# Altium project RUT_xE310_GNSS.PrjPCB
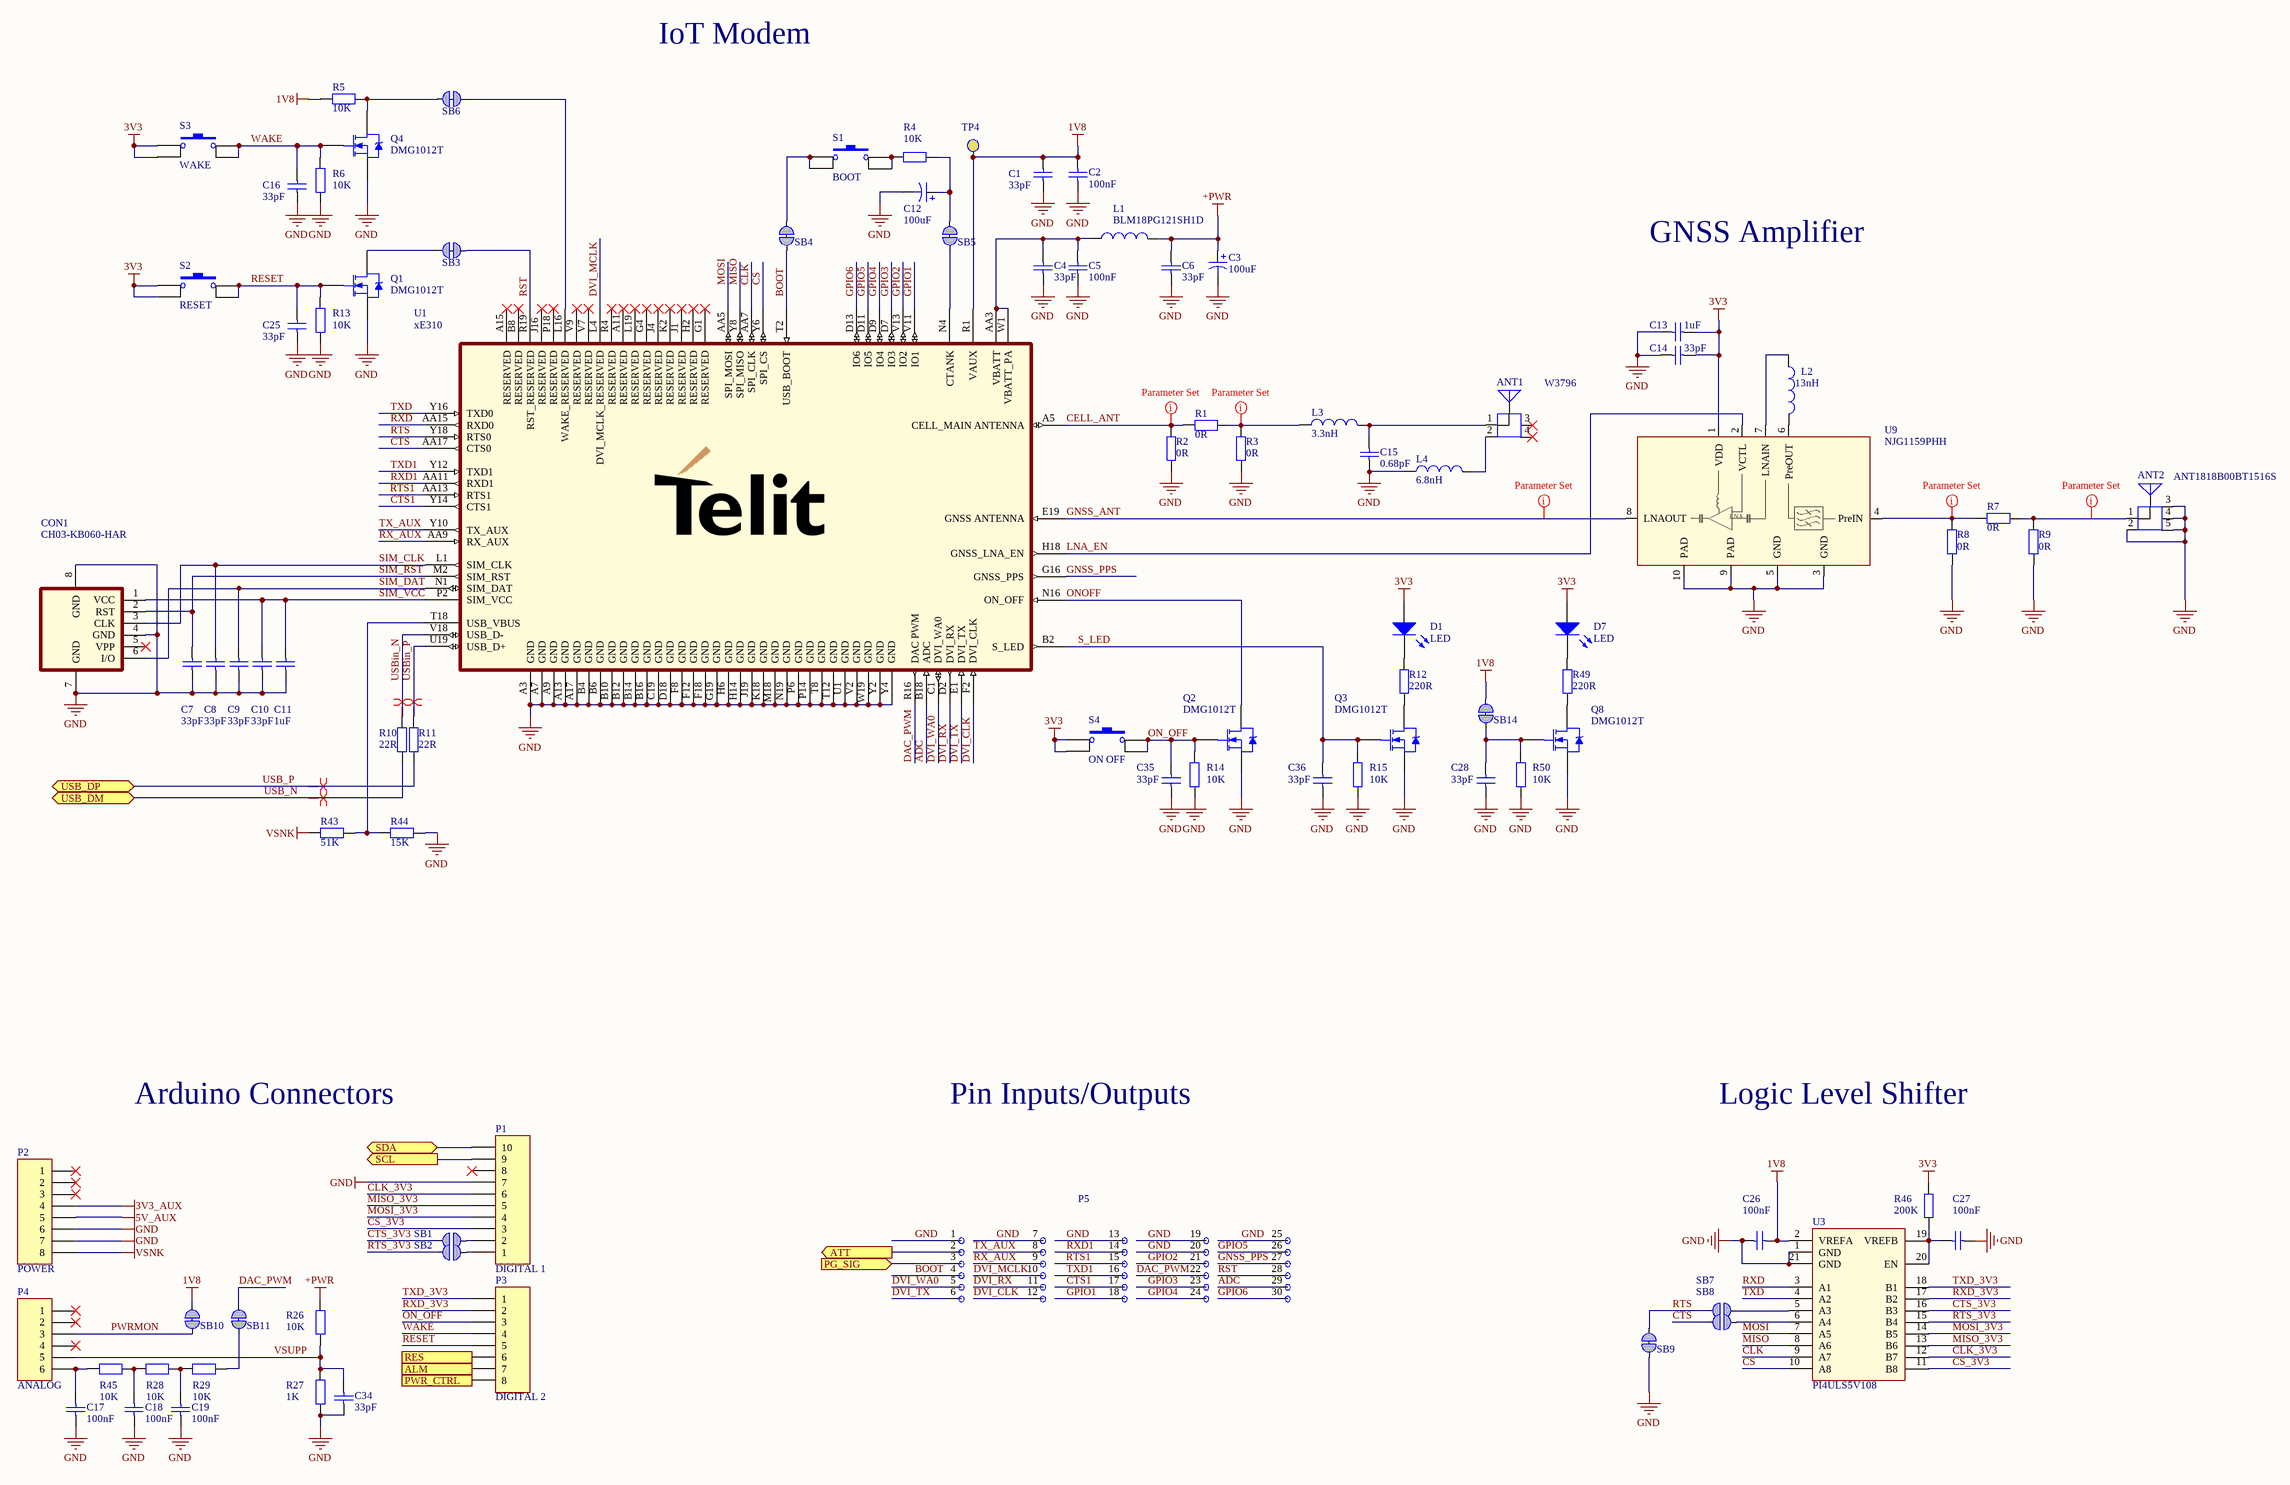
[diagram p0: Main_Schematic.SchDoc]
3 sheets, 158 parts. Net scope: flat (ports and power ports of the same name join across sheets).
Board files: RUT_xE310_PCB.PcbDoc, RUT_xE310_Panel.PcbDoc
Sheets:
  Main_Schematic.SchDoc
  USBPD_Sink.SchDoc
  Power.SchDoc

## Sheet Main_Schematic.SchDoc
size A2

### Parts
ANT1  W3796  [W3796]
ANT2  ANT1818B00BT1516S  [ANT1818B00BT1516S]
C1  value 33pF  [C0402]  (hidden comment: Cap Semi)
C2  value 100nF  [C0402]  (hidden comment: Cap Semi)
C3  value 100uF  [Case-B]  (hidden comment: electrolytic capacitor)
C4  value 33pF  [C0402]  (hidden comment: Cap Semi)
C5  value 100nF  [C0402]  (hidden comment: Cap Semi)
C6  value 33pF  [C0402]  (hidden comment: Cap Semi)
C7  value 33pF  [C0402]  (hidden comment: Cap Semi)
C8  value 33pF  [C0402]  (hidden comment: Cap Semi)
C9  value 33pF  [C0402]  (hidden comment: Cap Semi)
C10  value 33pF  [C0402]  (hidden comment: Cap Semi)
C11  value 1uF  [C0402]  (hidden comment: Cap Semi)
C12  value 100uF  [Case-B]  (hidden comment: electrolytic capacitor)
C13  value 1uF  [C0402]  (hidden comment: Cap Semi)
C14  value 33pF  [C0402]  (hidden comment: Cap Semi)
C15  value 0.68pF  [C0402]  (hidden comment: Cap Semi)
C16  value 33pF  [C0402]  (hidden comment: Cap Semi)
C17  value 100nF  [C0402]  (hidden comment: Cap Semi)
C18  value 100nF  [C0402]  (hidden comment: Cap Semi)
C19  value 100nF  [C0402]  (hidden comment: Cap Semi)
C25  value 33pF  [C0402]  (hidden comment: Cap Semi)
C26  value 100nF  [C0402]  (hidden comment: Cap Semi)
C27  value 100nF  [C0402]  (hidden comment: Cap Semi)
C28  value 33pF  [C0402]  (hidden comment: Cap Semi)
C34  value 33pF  [C0402]  (hidden comment: Cap Semi)
C35  value 33pF  [C0402]  (hidden comment: Cap Semi)
C36  value 33pF  [C0402]  (hidden comment: Cap Semi)
CON1  CH03-KB060-HAR  [CH03-KB]
D1  LED  [PICOLED]
D7  LED  [PICOLED]
L1  value BLM18PG121SH1D  [L0603]  (hidden comment: Inductor)
L2  value 13nH  [L0402]  (hidden comment: Inductor)
L3  value 3.3nH  [L0603]  (hidden comment: Inductor)
L4  value 6.8nH  [L0603]  (hidden comment: Inductor)
P1  DIGITAL 1  [HDR1X10]
P2  POWER  [HDR1X8]  (no BOM)
P3  DIGITAL 2  [HDR1X8]  (no BOM)
P4  ANALOG  [HDR1X6]  (no BOM)
P5  THT_Matrix  [THT_Matrix_5x6]  (value not drawn)  (no BOM)
Q1  DMG1012T  [SOT-523_custom]
Q2  DMG1012T  [SOT-523_custom]
Q3  DMG1012T  [SOT-523_custom]
Q4  DMG1012T  [SOT-523_custom]
Q8  DMG1012T  [SOT-523_custom]
R1  value 0R  [R0402]  (hidden comment: Res2)
R2  value 0R  [R0402]  (hidden comment: Res2)
R3  value 0R  [R0402]  (hidden comment: Res2)
R4  value 10K  [R0402]  (hidden comment: Res2)
R5  value 10K  [R0402]  (hidden comment: Res2)
R6  value 10K  [R0402]  (hidden comment: Res2)
R7  value 0R  [R0402]  (hidden comment: Res2)
R8  value 0R  [R0402]  (hidden comment: Res2)
R9  value 0R  [R0402]  (hidden comment: Res2)
R10  value 22R  [R0402]  (hidden comment: Res2)
R11  value 22R  [R0402]  (hidden comment: Res2)
R12  value 220R  [R0402]  (hidden comment: Res2)
R13  value 10K  [R0402]  (hidden comment: Res2)
R14  value 10K  [R0402]  (hidden comment: Res2)
R15  value 10K  [R0402]  (hidden comment: Res2)
R26  value 10K  [R0402]  (hidden comment: Res2)
R27  value 1K  [R0402]  (hidden comment: Res2)
R28  value 10K  [R0402]  (hidden comment: Res2)
R29  value 10K  [R0402]  (hidden comment: Res2)
R43  value 51K  [R0402]  (hidden comment: Res2)
R44  value 15K  [R0402]  (hidden comment: Res2)
R45  value 10K  [R0402]  (hidden comment: Res2)
R46  value 200K  [R0402]  (hidden comment: Res2)
R49  value 220R  [R0402]  (hidden comment: Res2)
R50  value 10K  [R0402]  (hidden comment: Res2)
S1  BOOT  [EVPAA002K]
S2  RESET  [EVPAA002K]
S3  WAKE  [EVPAA002K]
S4  ON OFF  [EVQPUA]
SB1  Solderbridge  [Solderbridge]  (value not drawn)  (no BOM)
SB2  Solderbridge  [Solderbridge]  (value not drawn)  (no BOM)
SB3  Solderbridge  [Solderbridge_Shorted]  (value not drawn)  (net tie, no BOM)
SB4  Solderbridge  [Solderbridge_Shorted]  (value not drawn)  (net tie, no BOM)
SB5  Solderbridge  [Solderbridge_Shorted]  (value not drawn)  (net tie, no BOM)
SB6  Solderbridge  [Solderbridge_Shorted]  (value not drawn)  (net tie, no BOM)
SB7  Solderbridge  [Solderbridge]  (value not drawn)  (no BOM)
SB8  Solderbridge  [Solderbridge]  (value not drawn)  (no BOM)
SB9  Solderbridge  [Solderbridge_Shorted]  (value not drawn)  (net tie, no BOM)
SB10  Solderbridge  [Solderbridge_Shorted]  (value not drawn)  (net tie, no BOM)
SB11  Solderbridge  [Solderbridge_Shorted]  (value not drawn)  (net tie, no BOM)
SB14  Solderbridge  [Solderbridge_Shorted]  (value not drawn)  (net tie, no BOM)
TP4  Test_Point  [TEST_POINT]  (value not drawn)  (no BOM)
U1  xE310  [LGA_GE310]
U3  PI4ULS5V108  [VQFN-20]
U9  NJG1159PHH  [HFFP10-HH]

### Ports
ALM (out), ATT (out), PG_SIG (in), PWR_CTRL (out), RES (out), SCL (out), SDA (bidir), USB_DM (bidir), USB_DP (bidir)

### Nets
1V8: C1.1 C2.2 C26.2 R5.2 SB10.1 SB14.1 TP4.0 U1.R1(VAUX) U3.2(VREFA)
3V3: C13.1 C14.1 D1.1(A) D7.1(A) R46.2 S2.1 S2.4 S3.1 S3.4 S4.1 S4.3 U9.1(VDD)
3V3_AUX: P2.4
5V_AUX: P2.5
+PWR: C3.1 C6.2 L1.2 R26.2
GND: ANT2.2 ANT2.3 ANT2.4 ANT2.5 C1.2 C2.1 C3.2 C4.1 C5.1 C6.1 C7.2 C8.2 C9.2 C10.2 C11.1 C12.2 C13.2 C14.2 C15.2 C16.2 C17.2 C18.2 C19.2 C25.2 C26.1 C27.2 C28.2 C34.1 C35.2 C36.2 CON1.4(GND) CON1.7(GND) CON1.8(GND) L4.1 P1.7 P2.6 P2.7 P5.1 P5.7 P5.13 P5.19 P5.20 P5.25 Q1.3(S) Q2.3(S) Q3.3(S) Q4.3(S) Q8.3(S) R2.2 R3.2 R6.1 R8.2 R9.2 R13.1 R14.1 R15.1 R27.1 R44.1 R50.1 SB9.2 U1.A3(GND) U1.A7(GND) U1.A9(GND) U1.A13(GND) U1.A17(GND) U1.B4(GND) U1.B6(GND) U1.B10(GND) U1.B12(GND) U1.B14(GND) U1.B16(GND) U1.C19(GND) U1.D18(GND) U1.F8(GND) U1.F12(GND) U1.F18(GND) U1.G19(GND) U1.H6(GND) U1.H14(GND) U1.J19(GND) U1.K18(GND) U1.M18(GND) U1.N19(GND) U1.P6(GND) U1.P14(GND) U1.T8(GND) U1.T12(GND) U1.U1(GND) U1.V2(GND) U1.W19(GND) U1.Y2(GND) U1.Y4(GND) U3.1(GND) U3.21(GND) U9.3(GND) U9.5(GND) U9.9(PAD) U9.10(PAD)
VSNK: P2.8 R43.2
ADC: P5.29 U1.B18(ADC)
ALARM: P3.7 ; port ALM
BOOT: P5.4 SB4.2 U1.T2(USB_BOOT)
CELL_ANT: R1.2 R2.1 U1.A5(CELL_MAIN_ANTENNA)
CLK: U1.AA7(SPI_CLK) U3.9(A7)
CLK_3V3: P1.6 U3.12(B7)
CS: U1.Y6(SPI_CS) U3.10(A8)
CS_3V3: P1.3 U3.11(B8)
CTS: SB8.1 U1.AA17(CTS0)
CTS1: P5.17 U1.Y14(CTS1)
CTS_3V3: SB1.1 U3.16(B3)
DAC_PWM: P5.22 SB11.1 U1.R16(DAC_PWM)
DVI_CLK: P5.12 U1.F2(DVI_CLK)
DVI_MCLK: P5.10 U1.L4(DVI_MCLK_RESERVED)
DVI_RX: P5.11 U1.D2(DVI_RX)
DVI_TX: P5.6 U1.E1(DVI_TX)
DVI_WA0: P5.5 U1.C1(DVI_WA0)
GNSS_ANT: U1.E19(GNSS_ANTENNA) U9.8(LNAOUT)
GNSS_PPS: P5.27 U1.G16(GNSS_PPS)
GPIO1: P5.18 U1.V11(IO1)
GPIO2: P5.21 U1.V13(IO2)
GPIO3: P5.23 U1.D7(IO3)
GPIO4: P5.24 U1.D9(IO4)
GPIO5: P5.26 U1.D11(IO5)
GPIO6: P5.30 U1.D13(IO6)
LNA_EN: U1.H18(GNSS_LNA_EN) U9.2(VCTL)
MISO: U1.Y8(SPI_MISO) U3.8(A6)
MISO_3V3: P1.5 U3.13(B6)
MOSI: U1.AA5(SPI_MOSI) U3.7(A5)
MOSI_3V3: P1.4 U3.14(B5)
ON_OFF: C35.1 P3.3 Q2.1(G) R14.2 S4.2 S4.4
ONOFF: Q2.2(D) U1.N16(ON_OFF)
PG: P5.3 ; port PG_SIG
PWRMON: P4.3 SB10.2
RESET: C25.1 P3.5 Q1.1(G) R13.2 S2.2 S2.3
RST: P5.28 SB3.1 U1.R19(RST_RESERVED)
RTS: SB7.1 SB9.1 U1.Y18(RTS0)
RTS1: P5.15 U1.AA13(RTS1)
RTS_3V3: SB2.1 U3.15(B4)
RX_AUX: P5.9 U1.AA9(RX_AUX)
RXD: U1.AA15(RXD0) U3.3(A1)
RXD1: P5.14 U1.AA11(RXD1)
RXD_3V3: P3.2 U3.17(B2)
S_LED: C36.1 Q3.1(G) R15.2 U1.B2(S_LED)
SCL: P1.9 ; port SCL
SDA: P1.10 ; port SDA
SIM_CLK: C8.1 CON1.3(CLK) U1.L1(SIM_CLK)
SIM_DAT: C9.1 CON1.6(I/O) U1.N1(SIM_DAT)
SIM_RST: C7.1 CON1.2(RST) U1.M2(SIM_RST)
SIM_VCC: C10.1 C11.2 CON1.1(VCC) U1.P2(SIM_VCC)
TX_AUX: P5.8 U1.Y10(TX_AUX)
TXD: U1.Y16(TXD0) U3.4(A2)
TXD1: P5.16 U1.Y12(TXD1)
TXD_3V3: P3.1 U3.18(B1)
USB_N: R10.1 ; port USB_DM
USB_P: R11.1 ; port USB_DP
USBin_N: R10.2 U1.V18(USB_D-)
USBin_P: R11.2 U1.U19(USB_D+)
VSUPP: C34.2 P4.5 R26.1 R27.2
WAKE: C16.1 P3.4 Q4.1(G) R6.2 S3.2 S3.3
NetANT1_1: ANT1.1 C15.1 L3.2
NetANT1_2: ANT1.2 L4.2
NetANT2_1: ANT2.1 R7.1 R9.1
NetC4_2: C4.2 C5.2 L1.1 U1.AA3(VBATT) U1.W1(VBATT_PA)
NetC12_1: C12.1 R4.1 SB5.1
NetC17_1: C17.1 P4.6 R45.2
NetC18_1: C18.1 R28.2 R45.1
NetC19_1: C19.1 R28.1 R29.2
NetC27_1: C27.1 R46.1 U3.19(VREFB) U3.20(EN)
NetC28_1: C28.1 Q8.1(G) R50.2 SB14.2
NetC39_1: P3.8 ; port PWR_CTRL
NetD1_2: D1.2(K) R12.1
NetD7_2: D7.2(K) R49.1
NetL2_1: L2.1 U9.7(LNAIN)
NetL2_2: L2.2 U9.6(PreOUT)
NetL3_1: L3.1 R1.1 R3.1
NetP1_1: P1.1 SB2.2
NetP1_2: P1.2 SB1.2
NetP3_6: P3.6 ; port RES
NetP5_2: P5.2 ; port ATT
NetQ1_2: Q1.2(D) SB3.2
NetQ3_2: Q3.2(D) R12.2
NetQ4_2: Q4.2(D) R5.1 SB6.2
NetQ8_2: Q8.2(D) R49.2
NetR4_2: R4.2 S1.2 S1.3
NetR7_2: R7.2 R8.1 U9.4(PreIN)
NetR29_1: R29.1 SB11.2
NetR43_1: R43.1 R44.2 U1.T18(USB_VBUS)
NetS1_1: S1.1 S1.4 SB4.1
NetSB5_2: SB5.2 U1.N4(CTANK)
NetSB6_1: SB6.1 U1.L16(WAKE_RESERVED)
NetSB7_2: SB7.2 U3.5(A3)
NetSB8_2: SB8.2 U3.6(A4)

Not connected (* = marked no-connect by the designer): ANT1 3* 4*; CON1 5(VPP)*; P1 8*; P2 1* 2* 3*; P4 1* 2* 4*; U1 A11(RESERVED)* A15(RESERVED)* B8(RESERVED)* G1(RESERVED)* G4(RESERVED)* H2(RESERVED)* J1(RESERVED)* J4(RESERVED)* J16(RESERVED)* K2(RESERVED)* L19(RESERVED)* P18(RESERVED)* R4(RESERVED)* V7(RESERVED)* V9(RESERVED)*

### Layout directives
rule Clearance Constraint [Clearance = 0.2mm]; rule Width Constraint [Pref Width = 1.1mm    Min Width = 0.2mm    Max Width = 4mm]: CELL_ANT, GNSS_ANT, NetANT2_1, NetL3_1, NetR7_2
differential pair: USB_N, USB_P, USBin_N, USBin_P

### Notes on the sheet
- IoT Modem
- GNSS Amplifier
- Arduino Connectors
- Pin Inputs/Outputs
- Logic Level Shifter
- (in symbol NJG1159PHH) LNA

### Library data of the parts
ANT1 = Antenna: Generic Antenna; Manufacturer: Pulse; Part Description: LTE antenna; Specification: LTE; Manufacturer Part No.: W3796; Supplier: Rutronik; Supplier part number: WIREAC1998; Value: W3796; Link: https://www.pulselarsenantennas.com/product/w3796/
ANT2 = Antenna: Generic Antenna; Manufacturer: Yegeo; Part Description: GPS/Glonass Antenna; Specification: 1.575/1.602 GHz; Manufacturer Part No.: ANT1818B00BT1516S; Supplier: Rutronik; Supplier part number: WIREAC1868; Value: ANT1818B00BT1516S; Link: https://www.rutronik24.com/search-result/qs:ANT1818B00BT1516S/reset:0
C1 C4 C6-C10 C14 C16 C25 C28 C34-C36 = Cap Semi: Capacitor (Semiconductor SIM Model); Manufacturer: AVX; Manufacturer Part No.: 04025A330JAT2A; Part Description: Ceramic Capacitor; Specification: NP0, 50V, 5%; Supplier: Rutronik; Supplier part number: KKK13594; Link: https://www.rutronik24.com/product/avx/04025a330jat2a/3692730.html
C2 C5 C17-C19 C26 C27 = Cap Semi: Capacitor (Semiconductor SIM Model); Manufacturer: YAGEO; Manufacturer Part No.: CC0402KRX7R9BB104; Part Description: Ceramic Capacitor; Specification: X7R, 50V, 10%; Supplier: Rutronik; Supplier part number: KKK23619; Link: https://www.rutronik24.com/search-result/qs:KKK23619/reset:0
C3 C12 = Cap Pol1: Manufacturer: AVX; Manufacturer Part No.: TPSB107M006R0250; Part Description: Tantalum Capacitor; Specification: 6,3V 20%; Supplier: Rutronik; Supplier part number: TPSB107M006R0250; Link: https://www.rutronik24.com/search-result/qs:TPSB107M006R0250%20/reset:0
C11 C13 = Cap Semi: Capacitor (Semiconductor SIM Model); Manufacturer: muRata; Manufacturer Part No.: GRM155R61E105KA12D; Part Description: Ceramic Capacitor; Specification: X5R, 25V, 10%; Supplier: Rutronik; Supplier part number: KKS4987; Link: https://www.rutronik24.com/product/murata/grm155r61e105ka12d/4725132.html
C15 = Cap Semi: Capacitor (Semiconductor SIM Model); Manufacturer: YAGEO; Manufacturer Part No.: CC0402BRNPO9BNR68; Part Description: Ceramic Capacitor; Specification: NP0, 50V, 0.1pf; Supplier: Rutronik; Supplier part number: KKK18710; Link: https://www.rutronik24.com/category/ceramic-chip-commodity/case-size:0402/cn:0%252C68p/move:0
CON1 = CH03-KB060-HAR: Nano SIM Card Connector; Manufacturer: GradConn; Specification: Nano, 6 pins; Manufacturer Part No.: CH03-KB060-HAR; Supplier: Rutronik; Supplier part number: SIMCRD1002; Value: CH03-KB060-HAR; Part Description: Nano SIM Card Connector; Link: https://www.rutronik24.com/product/gradconn/ch03-kb060-har/7026333.html
D1 D7 = LED2: Typical SMD LED; Manufacturer: OSRAM; Manufacturer Part No.: LTQH9G-Q2OO-25-2Z4Y-5-R18; Specification: Green, 5mA; Value: LTQH9G-Q2OO-25-2Z4Y-5-R18; Supplier: Rutronik; Supplier part number: LED22816; Part Description: Typical SMD LED; Link: https://www.rutronik24.com/product/osram/ltqh9g-q2oo-25-2z4y-5-r18/7461152.html
L1 = Inductor: Manufacturer: muRata; Part Description: Ferrite Bead; Specification: 120R, 2A; Manufacturer Part No.: BLM18PG121SH1D; Supplier: Rutronik; Supplier part number: FE3867; Link: https://www.rutronik24.com/product/murata/blm18pg121sh1d/5885588.html
L2 = Inductor: Manufacturer: muRata; Manufacturer Part No.: LQW15AN13NG00D; Specification: 430mA, ±2%; Supplier: Rutronik; Supplier part number: LQW15AN13NG00D; Part Description: Inductor; Link: https://www.rutronik24.com/search-result/qs:%20LQW15AN13NG00D%20/reset:0
L3 = Inductor: Manufacturer: muRata; Manufacturer Part No.: LQG18HN3N3S00D; Specification: 500mA +/-0,3nH; Supplier: Rutronik; Supplier part number: IND5373; Part Description: Inductor; Link: https://www.rutronik24.com/search-result/qs:LQG18HN3N3S00D%20/reset:0
L4 = Inductor: Manufacturer: muRata; Manufacturer Part No.: LQW18AN6N8D10D; Specification: 900mA, ±0.5nH; Supplier: Rutronik; Supplier part number: LQW18AN6N8D10D; Part Description: Inductor; Link: https://www.rutronik24.com/search-result/qs:LQW18AN6N8D10D/reset:0
P1 = Header 10: Manufacturer: SparkFun Electronics; Manufacturer Part No.: PRT-11417; Part Description: Arduino Stackable Header Kit; Specification: 10 pos. 2,54mm; Value: PRT-11417; Supplier: Digi-Key; Supplier part number: 1568-1413-ND; Link: https://www.digikey.com/products/en?keywords=1568-1413-ND
P2 P3 = Header 8: Part Description: Arduino Connector; Specification: 8 pos. 2,54mm; Supplier: Rutronik
P4 = Header 6: Part Description: Arduino Connector; Specification: 6 pos. 2,54mm; Supplier: Rutronik
P5 = THT_Matrix: Pin matrix, 6 rows, 5 columns, 2.54mm pitch
Q1-Q4 Q8 = NMOS-2: N-Channel Power MOSFET; Manufacturer: Diodes Inc.; Manufacturer Part No.: DMG1012T-7; Part Description: N-Channel MOSFET; Specification: 20V, 0.63A; Value: DMG1012T-7; Supplier: Rutronik; Supplier part number: TMOSS6623; Link: https://www.rutronik24.com/product/diodes+inc/dmg1012t-7/5168665.html
R1-R3 R7-R9 = Res2: Manufacturer: YAGEO; Manufacturer Part No.: RC0402FR-070RL; Part Description: Thick Film Resistor; Specification: 5% 0,063W; Supplier: Rutronik; Supplier part number: WRC53079; Link: https://www.rutronik24.com/product/yageo/rc0402fr-070rl/5183530.html
R4-R6 R13-R15 R26 R28 R29 R45 R50 = Res2: Manufacturer: ASJ; Manufacturer Part No.: CR10-103-JK; Part Description: Thick Film Resistor; Specification: 5% 0,063W; Supplier: Rutronik; Supplier part number: WRC40976; Link: https://www.rutronik24.com/product/asj/cr10-103-jk/54295.html
R10 R11 = Res2: Manufacturer: ASJ; Manufacturer Part No.: CR10-220-JK; Part Description: Thick Film Resistor; Specification: 5% 0,063W; Supplier: Rutronik; Supplier part number: WRC34862; Link: https://www.rutronik24.com/product/asj/cr10-220-jk/51754.html
R12 R49 = Res2: Manufacturer: ASJ; Manufacturer Part No.: CR10-221-JK; Part Description: Thick Film Resistor; Specification: 5% 0,063W; Supplier: Rutronik; Supplier part number: WRC35108; Link: https://www.rutronik24.com/product/asj/cr10-221-jk/51883.html
R27 = Res2: Manufacturer: ASJ; Manufacturer Part No.: CR10-102-JK; Part Description: Thick Film Resistor; Specification: 5% 0,063W; Supplier: Rutronik; Supplier part number: WRC41426; Link: https://www.rutronik24.com/search-result/qs:CR10-102-JK/reset:0
R43 = Res2: Manufacturer: YAGEO; Manufacturer Part No.: RC0402JR-0751KL; Part Description: Thick Film Resistor; Specification: 5% 0,063W; Supplier: Rutronik; Supplier part number: WRC33877; Link: https://www.rutronik24.com/product/yageo/rc0402jr-0751kl/51045.html
R44 = Res2: Manufacturer: ASJ; Manufacturer Part No.: CR10-153-JK; Part Description: Thick Film Resistor; Specification: 5% 0,063W; Supplier: Rutronik; Supplier part number: WRC41435; Link: https://www.rutronik24.com/product/asj/cr10-153-jk/54400.html
R46 = Res2: Manufacturer: ASJ; Manufacturer Part No.: CR10-204-JK; Part Description: Thick Film Resistor; Specification: 5% 0,063W; Supplier: Rutronik; Supplier part number: WRC55047; Link: https://www.rutronik24.com/product/asj/cr10-204-jk/6641528.html
S1-S3 = EVPAA002K: Switch; Manufacturer: Panasonic; Part Description: Tactile Button; Specification: 1N, Straight , 20mA; Manufacturer Part No.: EVPAA002K; Supplier: Rutronik; Supplier part number: EVPAA002K; Value: EVPAA002K; Link: https://www.rutronik24.com/search-result/qs:EVPAA002K/reset:0
S4 = SW-PB: Switch; Manufacturer: Panasonic; Manufacturer Part No.: EVQPUJ02K; Part Description: Tactile Button; Specification: 1.6N, Right Angle, 50mA; Value: EVQPUJ02K; Supplier: Rutronik; Supplier part number: EVQPUJ02K; Link: https://www.rutronik24.com/search-result/qs:EVQPUJ02K/reset:0
SB3-SB6 SB9-SB11 SB14 = Solderbridge Shorted: Manufacturer: *; Value: Solderbridge; Supplier: *; Supplier part number: *
TP4 = Test_Point: Test Point
U1 = xE310-GNSS: xE310-GNSS IoT Modem; Manufacturer: Telit; Manufacturer Part No.: ME310G1-WW; Part Description: LTE M1/NB2 WW 2G/FB +GNSS; Specification: xE310 SMD LGA; Value: ME310G1-WW; Link: https://www.rutronik24.com/product/telit/mkt39902511798/13429520.html; Supplier: Rutronik; Supplier part number: GSM1995
U3 = PI4ULS5V108: 8-Bit Bi-directional Level Shifter for Open-Drain and Push-Pull Application; Manufacturer: Diodes Inc.; Part Description: 8-Bit Bi-direction Level Shifter; Specification: 5V, 8bit, 100MHz; Link: https://www.diodes.com/part/view/PI4ULS5V108; Manufacturer Part No.: PI4ULS5V108; Supplier: Rutronik; Supplier part number: PI4ULS5V108; Value: PI4ULS5V108
U9 = NJG1159PHH: GNSS Front-End Module; Manufacturer: New Japan Radio; Manufacturer Part No.: NJG1159PHH-TE1; Specification: 3.3V, 3.7mA; Value: NJG1159PHH-TE1; Link: https://www.rutronik24.com/search-result/qs:NJG1159PHH/reset:0; Part Description: GNSS Front-End Module; Supplier: Rutronik; Supplier part number: ICOP7179
SB1 SB2 SB7 SB8 = Solderbridge: Manufacturer: *; Value: Solderbridge; Supplier: *; Supplier part number: *

## Sheet USBPD_Sink.SchDoc
size A3
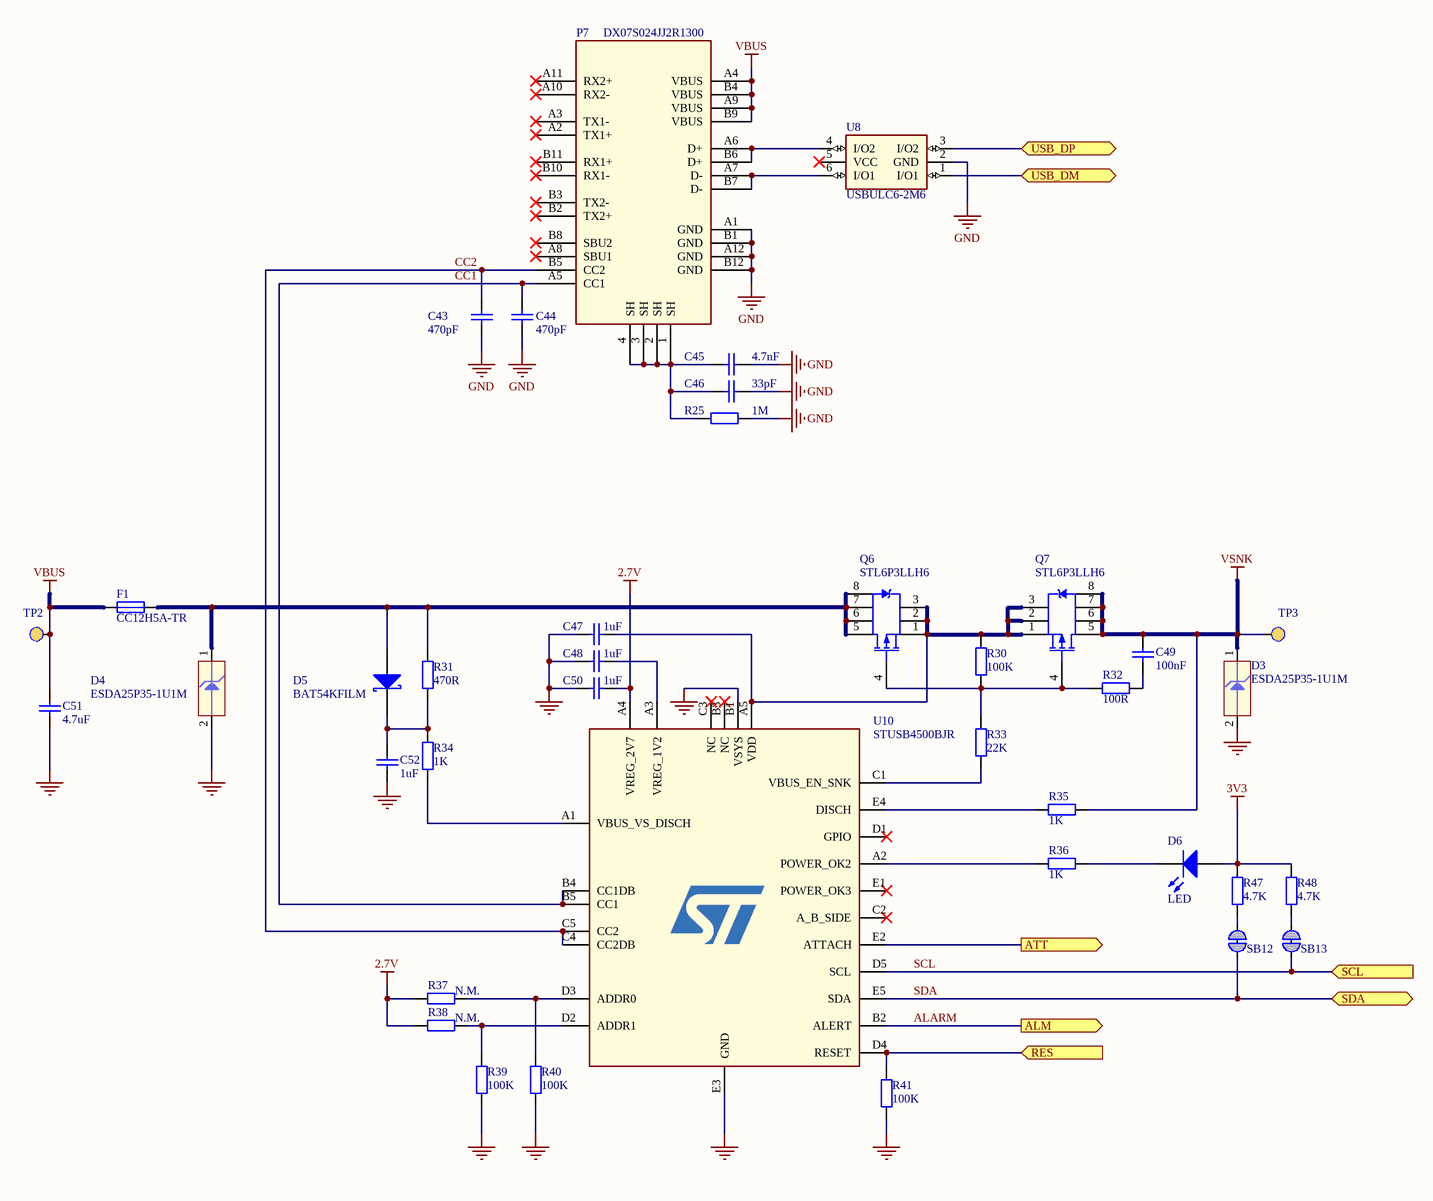
[diagram p1: USBPD_Sink.SchDoc]

### Parts
C43  value 470pF  [C0402]  (hidden comment: Cap Semi)
C44  value 470pF  [C0402]  (hidden comment: Cap Semi)
C45  value 4.7nF  [C0402]  (hidden comment: Cap Semi)
C46  value 33pF  [C0402]  (hidden comment: Cap Semi)
C47  value 1uF  [C0402]  (hidden comment: Cap Semi)
C48  value 1uF  [C0402]  (hidden comment: Cap Semi)
C49  value 100nF  [C0402]  (hidden comment: Cap Semi)
C50  value 1uF  [C0402]  (hidden comment: Cap Semi)
C51  value 4.7uF  [C0603]  (hidden comment: Cap Semi)
C52  value 1uF  [C0402]  (hidden comment: Cap Semi)
D3  ESDA25P35-1U1M  [QFN1610]
D4  ESDA25P35-1U1M  [QFN1610]
D5  BAT54KFILM  [SOD-523]
D6  LED  [PICOLED]
F1  CC12H5A-TR  [R1206]
P7  DX07S024JJ2R1300  [DX07_USB_C]
Q6  STL6P3LLH6  [PowerFLAT™ 3.3 x 3.3]
Q7  STL6P3LLH6  [PowerFLAT™ 3.3 x 3.3]
R25  value 1M  [R0402]  (hidden comment: Res2)
R30  value 100K  [R0402]  (hidden comment: Res2)
R31  value 470R  [R0402]  (hidden comment: Res2)
R32  value 100R  [R0402]  (hidden comment: Res2)
R33  value 22K  [R0402]  (hidden comment: Res2)
R34  value 1K  [R0402]  (hidden comment: Res2)
R35  value 1K  [R0402]  (hidden comment: Res2)
R36  value 1K  [R0402]  (hidden comment: Res2)
R37  value N.M.  [R0402]  (hidden comment: Res2)  (no BOM)
R38  value N.M.  [R0402]  (hidden comment: Res2)  (no BOM)
R39  value 100K  [R0402]  (hidden comment: Res2)
R40  value 100K  [R0402]  (hidden comment: Res2)
R41  value 100K  [R0402]  (hidden comment: Res2)
R47  value 4.7K  [R0402]  (hidden comment: Res2)
R48  value 4.7K  [R0402]  (hidden comment: Res2)
SB12  Solderbridge  [Solderbridge_Shorted]  (value not drawn)  (net tie, no BOM)
SB13  Solderbridge  [Solderbridge_Shorted]  (value not drawn)  (net tie, no BOM)
TP2  Test_Point  [TEST_POINT]  (value not drawn)  (no BOM)
TP3  Test_Point  [TEST_POINT]  (value not drawn)  (no BOM)
U8  USBULC6-2M6  [Micro_QFN_6L]
U10  STUSB4500BJR  [WLCSP 2.6x2.6x0.5]

### Ports
ALM (out), ATT (out), RES (in), SCL (in), SDA (bidir), USB_DM (bidir), USB_DP (bidir)

### Nets
2.7V: C50.1 R37.1 R38.1 U10.A4(VREG_2V7)
3V3: D6.1(A) R47.1 R48.1
GND: C43.1 C44.1 C45.1 C46.1 C47.2 C48.2 C50.2 C51.2 C52.2 D3.2(PIN2) D4.2(PIN2) P7.A1(GND) P7.A12(GND) P7.B1(GND) P7.B12(GND) R25.1 R39.2 R40.2 R41.2 U8.2(GND) U10.B1(VSYS) U10.E3(GND)
VBUS: C51.1 F1.2 P7.A4(VBUS) P7.A9(VBUS) P7.B4(VBUS) P7.B9(VBUS) TP2.0
VSNK: C49.2 D3.1(PIN1) Q7.5(D) Q7.6(D) Q7.7(D) Q7.8(D) R35.2 TP3.0
ALARM: U10.B2(ALERT) ; port ALM
CC1: C44.2 P7.A5(CC1) U10.B4(CC1DB) U10.B5(CC1)
CC2: C43.2 P7.B5(CC2) U10.C4(CC2DB) U10.C5(CC2)
SCL: SB13.2 U10.D5(SCL) ; port SCL
SDA: SB12.2 U10.E5(SDA) ; port SDA
USB_N: U8.1(I/O1) ; port USB_DM
USB_P: U8.3(I/O2) ; port USB_DP
NetC45_2: C45.2 C46.2 P7.1(SH) P7.2(SH) P7.3(SH) P7.4(SH) R25.2
NetC47_1: C47.1 Q6.1(S) Q6.2(S) Q6.3(S) Q7.1(S) Q7.2(S) Q7.3(S) R30.1 U10.A5(VDD)
NetC48_1: C48.1 U10.A3(VREG_1V2)
NetC49_1: C49.1 R32.2
NetC52_1: C52.1 D5.2(K) R31.2 R34.1
NetD4_1: D4.1(PIN1) D5.1(A) F1.1 Q6.5(D) Q6.6(D) Q6.7(D) Q6.8(D) R31.1
NetD6_2: D6.2(K) R36.2
NetP3_6: R41.1 U10.D4(RESET) ; port RES
NetP5_2: U10.E2(ATTACH) ; port ATT
NetP7_A6: P7.A6(D+) P7.B6(D+) U8.4(I/O2)
NetP7_A7: P7.A7(D-) P7.B7(D-) U8.6(I/O1)
NetQ6_4: Q6.4(G) Q7.4(G) R30.2 R32.1 R33.1
NetR33_2: R33.2 U10.C1(VBUS_EN_SNK)
NetR34_2: R34.2 U10.A1(VBUS_VS_DISCH)
NetR35_1: R35.1 U10.E4(DISCH)
NetR36_1: R36.1 U10.A2(POWER_OK2)
NetR37_2: R37.2 R40.1 U10.D3(ADDR0)
NetR38_2: R38.2 R39.1 U10.D2(ADDR1)
NetR47_2: R47.2 SB12.1
NetR48_2: R48.2 SB13.1

Not connected (* = marked no-connect by the designer): P7 A2(TX1+)* A3(TX1-)* A8(SBU1)* A10(RX2-)* A11(RX2+)* B2(TX2+)* B3(TX2-)* B8(SBU2)* B10(RX1-)* B11(RX1+)*; U8 5(VCC)*; U10 B3(NC)* C2(A_B_SIDE)* C3(NC)* D1(GPIO)* E1(POWER_OK3)*

### Library data of the parts
C43 C44 = Cap Semi: Capacitor (Semiconductor SIM Model); Manufacturer: Samsung EM; Manufacturer Part No.: CL05C471JB5NNNC; Part Description: Ceramic Capacitor; Specification: NP0, 50V, 5%; Supplier: Rutronik; Supplier part number: KKK18704; Link: https://www.rutronik24.com/product/samsung+em/cl05c471jb5nnnc/30810.html
C45 = Cap Semi: Capacitor (Semiconductor SIM Model); Manufacturer: YAGEO; Manufacturer Part No.: CC0402KRX7R9BB472; Part Description: Ceramic Capacitor; Specification: X7R, 50V, 10%; Supplier: Rutronik; Supplier part number: KKK17246; Link: https://www.rutronik24.com/search-result/qs:KKK17246/reset:0
C46 = Cap Semi: as C1 on sheet Main_Schematic; Supplier: Rutronik; Supplier part number: KKK13594; Link: https://www.rutronik24.com/product/avx/04025a330jat2a/3692730.html
C47 C48 C50 C52 = Cap Semi: as C11 on sheet Main_Schematic; Supplier: Rutronik; Supplier part number: KKS4987; Link: https://www.rutronik24.com/product/murata/grm155r61e105ka12d/4725132.html
C49 = Cap Semi: as C2 on sheet Main_Schematic; Supplier: Rutronik; Supplier part number: KKK23619; Link: https://www.rutronik24.com/search-result/qs:KKK23619/reset:0
C51 = Cap Semi: Capacitor (Semiconductor SIM Model); Manufacturer: Samsung EM; Manufacturer Part No.: CL10A475KA8NQNC; Part Description: Ceramic Capacitor; Specification: X5R, 25V, 10%; Supplier: Rutronik; Supplier part number: KKS2862; Link: https://www.rutronik24.com/category-type/ceramic-chip-high-values/chip-cap-06031f/case-size:0603/cn:4%252C7%25C2%25B5/move:0/vn:25
D3 D4 = ESD_Diode: ESD Diode Symbol; Manufacturer: STMicroelectronics; Part Description: High power transient voltage suppressor; Specification: 22V, 1.4kW; Link: https://www.rutronik24.com/search-result/nojs:1337/qs:ESDA25P35-1U1M/reset:0; Manufacturer Part No.: ESDA25P35-1U1M; Supplier: Rutronik; Supplier part number: DTRL11228; Value: ESDA25P35-1U1M
D5 = D Schottky: Schottky Diode; Manufacturer: STMicroelectronics; Part Description: Small signal Schottky diode; Specification: 40V, 0.3A; Manufacturer Part No.: BAT54KFILM; Supplier: Rutronik; Supplier part number: DSKY5066; Value: BAT54KFILM; Link: https://www.rutronik24.com/search-result/nojs:1337/qs:BAT54KFILM/reset:0
D6 = LED2: as D1 on sheet Main_Schematic; Supplier: Rutronik; Supplier part number: LED22816; Part Description: Typical SMD LED; Link: https://www.rutronik24.com/product/osram/ltqh9g-q2oo-25-2z4y-5-r18/7461152.html
F1 = Fuse: Manufacturer: EATON; Part Description: High I²t Chip fuse; Specification: 32V, 5A; Link: https://www.rutronik24.com/search-result/nojs:1337/qs:CC12H5A-TR/reset:0; Manufacturer Part No.: CC12H5A-TR; Supplier: Rutronik; Supplier part number: FUSE7161; Value: CC12H5A-TR
P7 = DX07S024JJ2R1300: 24P USB C DUAL SMT ON BOARD; Manufacturer: JAE; Specification: Type C; Link: https://www.rutronik24.com/product/jae/dx07s024jj2r1300/8301548.html; Manufacturer Part No.: DX07S024JJ2R1300; Part Description: 24P USB C DUAL SMT ON BOARD; Supplier: Rutronik; Supplier part number: CONIO1808; Value: DX07S024JJ2R1300
Q6 Q7 = STL6P3LLH6: Power MOSFET; Manufacturer: STMicroelectronics; Part Description: P-channel Power MOSFET; Specification: 30V, 6A; Manufacturer Part No.: STL6P3LLH6; Supplier: Rutronik; Supplier part number: STL6P3LLH6; Value: STL6P3LLH6; Link: https://www.rutronik24.com/search-result/qs:STL6P3LLH6/reset:0
R25 = Res2: Manufacturer: ASJ; Manufacturer Part No.: CR10-105-JK; Part Description: Thick Film Resistor; Specification: 5% 0,063W; Supplier: Rutronik; Supplier part number: WRC35254; Link: https://www.rutronik24.com/product/asj/cr10-105-jk/51971.html
R30 R39-R41 = Res2: Manufacturer: ASJ; Manufacturer Part No.: CR10-104-JN; Part Description: Thick Film Resistor; Specification: 5% 0,063W; Supplier: Rutronik; Supplier part number: WRC57986; Link: https://www.rutronik24.com/product/asj/cr10-104-jn/9808104.html
R31 = Res2: Manufacturer: ASJ; Manufacturer Part No.: CR10-471-JK; Part Description: Thick Film Resistor; Specification: 5% 0,063W; Supplier: Rutronik; Supplier part number: WRC41425; Link: https://www.rutronik24.com/product/asj/cr10-471-jk/54391.html
R32 = Res2: Manufacturer: YAGEO; Manufacturer Part No.: RC0402JR-07100RL; Part Description: Thick Film Resistor; Specification: 5% 0,063W; Supplier: Rutronik; Supplier part number: WRC33811; Link: https://www.rutronik24.com/product/yageo/rc0402jr-07100rl/50982.html
R33 = Res2: Manufacturer: ASJ; Manufacturer Part No.: CR10-223-JK; Part Description: Thick Film Resistor; Specification: 5% 0,063W; Supplier: Rutronik; Supplier part number: WRC34603; Link: https://www.rutronik24.com/product/asj/cr10-223-jk/51597.html
R34-R36 = Res2: as R27 on sheet Main_Schematic; Supplier: Rutronik; Supplier part number: WRC41426; Link: https://www.rutronik24.com/search-result/qs:CR10-102-JK/reset:0
R37 R38 = Res2: Manufacturer: Yageo; Manufacturer Part No.: RC0402JR-0710KL; Part Description: Thick Film Resistor; Specification: 5% 0,063W; Supplier: Rutronik; Supplier part number: WRC33854; Link: https://www.rutronik24.com/search-result/nojs:1337/qs:RC0402JR-0710KL/reset:0
R47 R48 = Res2: Manufacturer: ASJ; Manufacturer Part No.: CR10-472-JK; Part Description: Thick Film Resistor; Specification: 5% 0,063W; Supplier: Rutronik; Supplier part number: WRC41427; Link: https://www.rutronik24.com/product/asj/cr10-472-jk/54393.html
SB12 SB13 = Solderbridge Shorted: Manufacturer: *; Value: Solderbridge; Supplier: *; Supplier part number: *
TP2 TP3 = Test_Point: Test Point
U8 = USBULC6-2M6: Ultra large bandwidth ESD protection; Manufacturer: STMicroelectronics; Specification: 6V, 0.6pF; Link: https://www.rutronik24.com/product/st/usbulc6-2m6/3623499.html; Manufacturer Part No.: USBULC6-2M6; Part Description: Ultra large bandwidth ESD protection; Supplier: Rutronik; Supplier part number: DTRL11259; Value: USBULC6-2M6
U10 = STUSB4500BJR: Standalone USB PD sink controller with short-to-VBUS protections; Manufacturer: STMicroelectronics; Part Description: Stand-alone USB PD controller; Rule: UNIONINDEX=0|RULEKIND=Clearance|NETSCOPE=DifferentNets|LAYERKIND=SameLayer|NAME=Schematic Clearance Constraint|GAP=3.937mil|GENERICCLEARANCE=3.937mil|IGNOREPADTOPADCLEARANCEINFOOTPRINT=FALSE|OBJECTCLEARANCES= |UNIT=Metric; Specification: 4.1V ~ 22V; Link: https://www.rutronik24.com/search-result/qs:STUSB4500BJR/reset:0; Manufacturer Part No.: STUSB4500BJR; Supplier: Rutronik; Supplier part number: STUSB4500BJR; Value: STUSB4500BJR

## Sheet Power.SchDoc
size A4
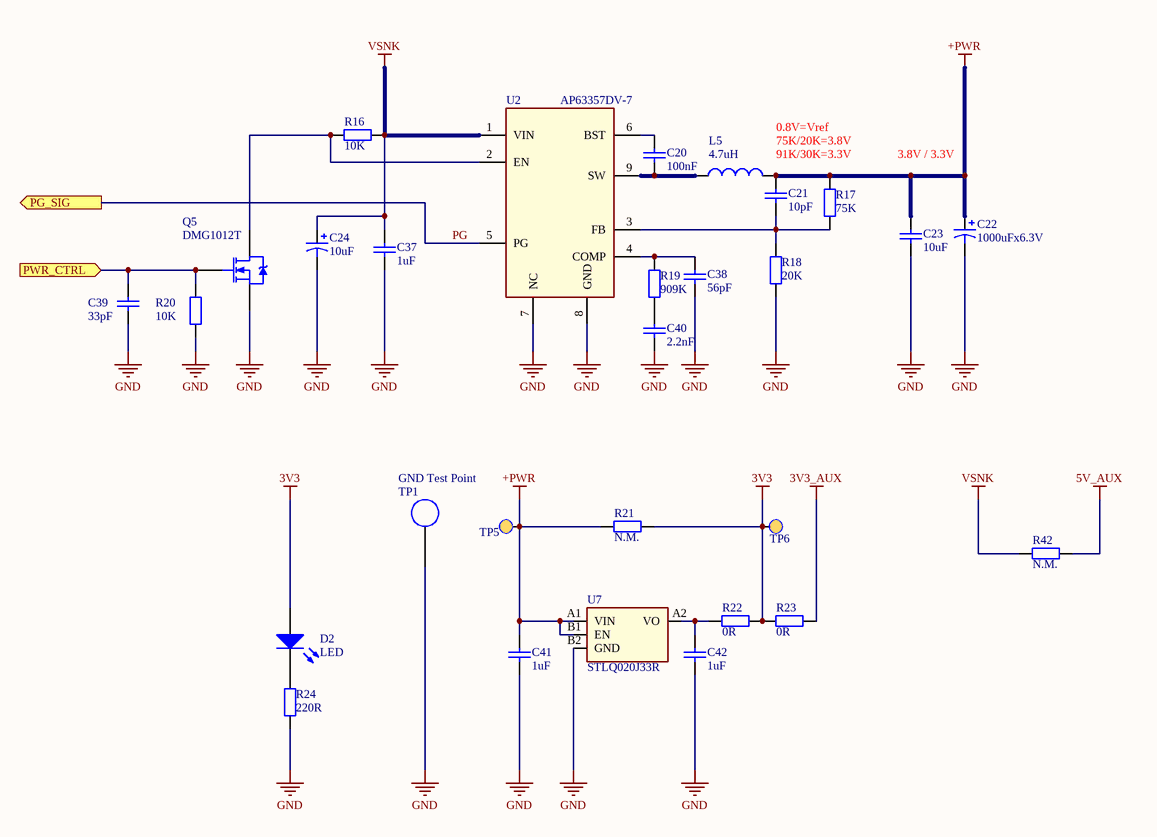
[diagram p2: Power.SchDoc]

### Parts
C20  value 100nF  [C0402]  (hidden comment: Cap Semi)
C21  value 10pF  [C0402]  (hidden comment: Cap Semi)
C22  value 1000uFx6.3V  [7361-38]  (hidden comment: electrolytic capacitor)
C23  value 10uF  [C0402]  (hidden comment: Cap Semi)
C24  value 10uF  [Case-B]  (hidden comment: electrolytic capacitor)
C37  value 1uF  [C0402]  (hidden comment: Cap Semi)
C38  value 56pF  [C0402]  (hidden comment: Cap Semi)
C39  value 33pF  [C0402]  (hidden comment: Cap Semi)
C40  value 2.2nF  [C0402]  (hidden comment: Cap Semi)
C41  value 1uF  [C0402]  (hidden comment: Cap Semi)
C42  value 1uF  [C0402]  (hidden comment: Cap Semi)
D2  LED  [PICOLED]
L5  value 4.7uH  [CHILSIN_5.4x5.7]  (hidden comment: Inductor)
Q5  DMG1012T  [SOT-523_custom]
R16  value 10K  [R0402]  (hidden comment: Res2)
R17  value 75K  [R0402]  (hidden comment: Res2)
R18  value 20K  [R0402]  (hidden comment: Res2)
R19  value 909K  [R0402]  (hidden comment: Res2)
R20  value 10K  [R0402]  (hidden comment: Res2)
R21  value N.M.  [R0402]  (hidden comment: Res2)  (no BOM)
R22  value 0R  [R0402]  (hidden comment: Res2)
R23  value 0R  [R0402]  (hidden comment: Res2)
R24  value 220R  [R0402]  (hidden comment: Res2)
R42  value N.M.  [R1206]  (hidden comment: Res2)  (no BOM)
TP1  GND Test Point  [5019_keystone]
TP5  Test_Point  [TEST_POINT]  (value not drawn)  (no BOM)
TP6  Test_Point  [TEST_POINT]  (value not drawn)  (no BOM)
U2  AP63357DV-7  [V-DFN3020-13]
U7  STLQ020J33R  [Flip-Chip4]

### Ports
PG_SIG (out), PWR_CTRL (in)

### Nets
3V3: D2.1(A) R21.1 R22.1 R23.2 TP6.0
3V3_AUX: R23.1
5V_AUX: R42.1
+PWR: C21.2 C22.1 C23.2 C41.1 L5.2 R17.1 R21.2 TP5.0 U7.A1(VIN) U7.B1(EN)
GND: C22.2 C23.1 C24.2 C37.1 C38.1 C39.2 C40.1 C41.2 C42.2 Q5.3(S) R18.2 R20.1 R24.2 TP1.1 U2.7(NC) U2.8(GND) U7.B2(GND)
VSNK: C24.1 C37.2 R16.2 R42.2 U2.1(VIN)
PG: U2.5(PG) ; port PG_SIG
NetC20_1: C20.1 U2.6(BST)
NetC20_2: C20.2 L5.1 U2.9(SW)
NetC21_1: C21.1 R17.2 R18.1 U2.3(FB)
NetC38_2: C38.2 R19.1 U2.4(COMP)
NetC39_1: C39.1 Q5.1(G) R20.2 ; port PWR_CTRL
NetC40_2: C40.2 R19.2
NetC42_1: C42.1 R22.2 U7.A2(VO)
NetD2_2: D2.2(K) R24.1
NetQ5_2: Q5.2(D) R16.1 U2.2(EN)

### Notes on the sheet
- 0.8V=Vref
- 91K/30K=3.3V
- 75K/20K=3.8V
- 3.8V / 3.3V

### Library data of the parts
C20 = Cap Semi: as C2 on sheet Main_Schematic; Supplier: Rutronik; Supplier part number: KKK23619; Link: https://www.rutronik24.com/search-result/qs:KKK23619/reset:0
C21 = Cap Semi: Capacitor (Semiconductor SIM Model); Manufacturer: YAGEO; Manufacturer Part No.: CC0402JRNPO9BN100; Part Description: Ceramic Capacitor; Specification: NP0, 50V, 5%; Supplier: Rutronik; Supplier part number: KKK14556; Link: https://www.rutronik24.com/product/yageo/cc0402jrnpo9bn100/29735.html
C22 = Cap Pol1: Manufacturer: AVX; Manufacturer Part No.: TPSV108M006R0050; Part Description: Tantalum Capacitor; Specification: 6,3V 20%; Supplier: Rutronik; Supplier part number: TPSV108M006R0050; Link: https://www.rutronik24.com/product/avx/tpsv108m006r0050/11647835.html
C23 = Cap Semi: Capacitor (Semiconductor SIM Model); Manufacturer: Samsung Electronics; Manufacturer Part No.: CL05A106MP5NUNC; Part Description: Ceramic Capacitor; Specification: X5R, 10V, 20%; Supplier: Rutronik; Supplier part number: KKS2857; Link: https://www.rutronik24.com/search-result/qs:KKS2857/reset:0
C24 = Cap Pol1: Manufacturer: AVX; Manufacturer Part No.: TCJB106M025R0100; Part Description: Tantalum Polymer Capacitor; Specification: Ta Poly, 25V, 20%; Supplier: Rutronik; Supplier part number: TCJB106M025R0100; Link: https://www.rutronik24.com/product/avx/tcjb106m025r0100/11642835.html
C37 C41 C42 = Cap Semi: as C11 on sheet Main_Schematic; Supplier: Rutronik; Supplier part number: KKS4987; Link: https://www.rutronik24.com/product/murata/grm155r61e105ka12d/4725132.html
C38 = Cap Semi: Capacitor (Semiconductor SIM Model); Manufacturer: YAGEO; Manufacturer Part No.: CC0402JRNPO9BN560; Part Description: Ceramic Capacitor; Specification: NP0, 50V, 5%; Supplier: Rutronik; Supplier part number: KKK13529; Link: https://www.rutronik24.com/product/yageo/cc0402jrnpo9bn560/29436.html
C39 = Cap Semi: as C1 on sheet Main_Schematic; Supplier: Rutronik; Supplier part number: KKK13594; Link: https://www.rutronik24.com/product/avx/04025a330jat2a/3692730.html
C40 = Cap Semi: Capacitor (Semiconductor SIM Model); Manufacturer: YAGEO; Manufacturer Part No.: CC0402KPX7R9BB222; Part Description: Ceramic Capacitor; Specification: X7R, 50V, 10%; Supplier: Rutronik; Supplier part number: KKK20885; Link: https://www.rutronik24.com/search-result/qs:KKK20885/reset:0
D2 = LED2: as D1 on sheet Main_Schematic; Supplier: Rutronik; Supplier part number: LED22816; Part Description: Typical SMD LED; Link: https://www.rutronik24.com/product/osram/ltqh9g-q2oo-25-2z4y-5-r18/7461152.html
L5 = Inductor: Manufacturer: CHILISIN; Manufacturer Part No.: BMRA000505204R7MA1; Specification: 3A, 20%; Supplier: Rutronik; Supplier part number: BMRA000505204R7MA1; Part Description: Inductor; Link: https://www.chilisin.com/en-global/Inductor/Product/BMRA_050520/BMRA000505204R7MA1
Q5 = NMOS-2: as Q1 on sheet Main_Schematic; Supplier: Rutronik; Supplier part number: TMOSS6623; Link: https://www.rutronik24.com/product/diodes+inc/dmg1012t-7/5168665.html
R16 R20 = Res2: as R4 on sheet Main_Schematic; Supplier: Rutronik; Supplier part number: WRC40976; Link: https://www.rutronik24.com/product/asj/cr10-103-jk/54295.html
R17 = Res2: Manufacturer: YAGEO; Manufacturer Part No.: RC0402JR-0775KL; Part Description: Thick Film Resistor; Specification: 5% 0,063W; Supplier: Rutronik; Supplier part number: WRC33884; Link: https://www.rutronik24.com/category-type/standard-chip-resistor/rchip-0402-5/move:0/resistor-value:75K
R18 = Res2: Manufacturer: YAGEO; Manufacturer Part No.: AC0402JR-0720KL; Part Description: Thick Film Resistor; Specification: 5% 0,063W; Supplier: Rutronik; Supplier part number: WRC53108; Link: https://www.rutronik24.com/product/yageo/ac0402jr-0720kl/1920796.html
R19 = Res2: Manufacturer: ASJ; Manufacturer Part No.: RC0402FR-07909KL; Part Description: Thick Film Resistor; Specification: 5% 0,063W; Supplier: Rutronik; Supplier part number: WRC34086; Link: https://www.rutronik24.com/category-type/standard-chip-resistor/rchip-0402-1/move:0/resistor-value:909K
R21-R23 R42 = Res2: as R1 on sheet Main_Schematic; Supplier: Rutronik; Supplier part number: WRC53079; Link: https://www.rutronik24.com/product/yageo/rc0402fr-070rl/5183530.html
R24 = Res2: as R12 on sheet Main_Schematic; Supplier: Rutronik; Supplier part number: WRC35108; Link: https://www.rutronik24.com/product/asj/cr10-221-jk/51883.html
TP1 = 5019: SMD Test Point; Manufacturer: Keystone Electrincs; Part Description: SMT Test Point; Specification: 3.81*2.03; Value: 5019; Manufacturer Part No.: 5019; Supplier: Rutronik; Supplier part number: BAT4950; Link: https://www.rutronik24.com/product/keystone/pn5019/7028403.html
TP5 TP6 = Test_Point: Test Point
U2 = AP63356: 3.8V TO 32VINPUT, 3.5A Low IQ Synchronous Buck with Enhanced EMI Reduction; Manufacturer: Diodes Inc.; Specification: 32V, 3.5A; Link: https://www.diodes.com/search/?q=AP63357DV-7+&t=keyword&action_results=Go; Manufacturer Part No.: AP63357DV-7; Part Description: 3.8V TO 32VINPUT, 3.5A Low IQ Synchronous Buck with Enhanced EMI Reduction; Supplier: Rutronik; Supplier part number: AP63357DV-7; Value: AP63357DV-7
U7 = STLQ020: LDO; Manufacturer: STMicroelectronics; Part Description: 200 mA ultra-low quiescent current LDO; Specification: 3.3V, 200mA; Manufacturer Part No.: STLQ020J33R; Supplier: Rutronik; Supplier part number: STLQ020J33R; Value: STLQ020J33R; Link: https://www.rutronik24.com/search-result/qs:STLQ020J33R/reset:0

## Nets that join several sheets
3V3: Main_Schematic (12 pins), USBPD_Sink (D6.1 R47.1 R48.1), Power (5 pins)
3V3_AUX: Main_Schematic (P2.4), Power (R23.1)
5V_AUX: Main_Schematic (P2.5), Power (R42.1)
+PWR: Main_Schematic (C3.1 C6.2 L1.2 R26.2), Power (10 pins)
GND: Main_Schematic (98 pins), USBPD_Sink (22 pins), Power (17 pins)
VSNK: Main_Schematic (P2.8 R43.2), USBPD_Sink (8 pins), Power (5 pins)
ALARM: Main_Schematic (P3.7), USBPD_Sink (U10.B2)
NetC39_1: Main_Schematic (P3.8), Power (C39.1 Q5.1 R20.2)
NetP3_6: Main_Schematic (P3.6), USBPD_Sink (R41.1 U10.D4)
NetP5_2: Main_Schematic (P5.2), USBPD_Sink (U10.E2)
PG: Main_Schematic (P5.3), Power (U2.5)
SCL: Main_Schematic (P1.9), USBPD_Sink (SB13.2 U10.D5)
SDA: Main_Schematic (P1.10), USBPD_Sink (SB12.2 U10.E5)
USB_N: Main_Schematic (R10.1), USBPD_Sink (U8.1)
USB_P: Main_Schematic (R11.1), USBPD_Sink (U8.3)